# EAGLE board raceCapture (EAGLE 5.12)
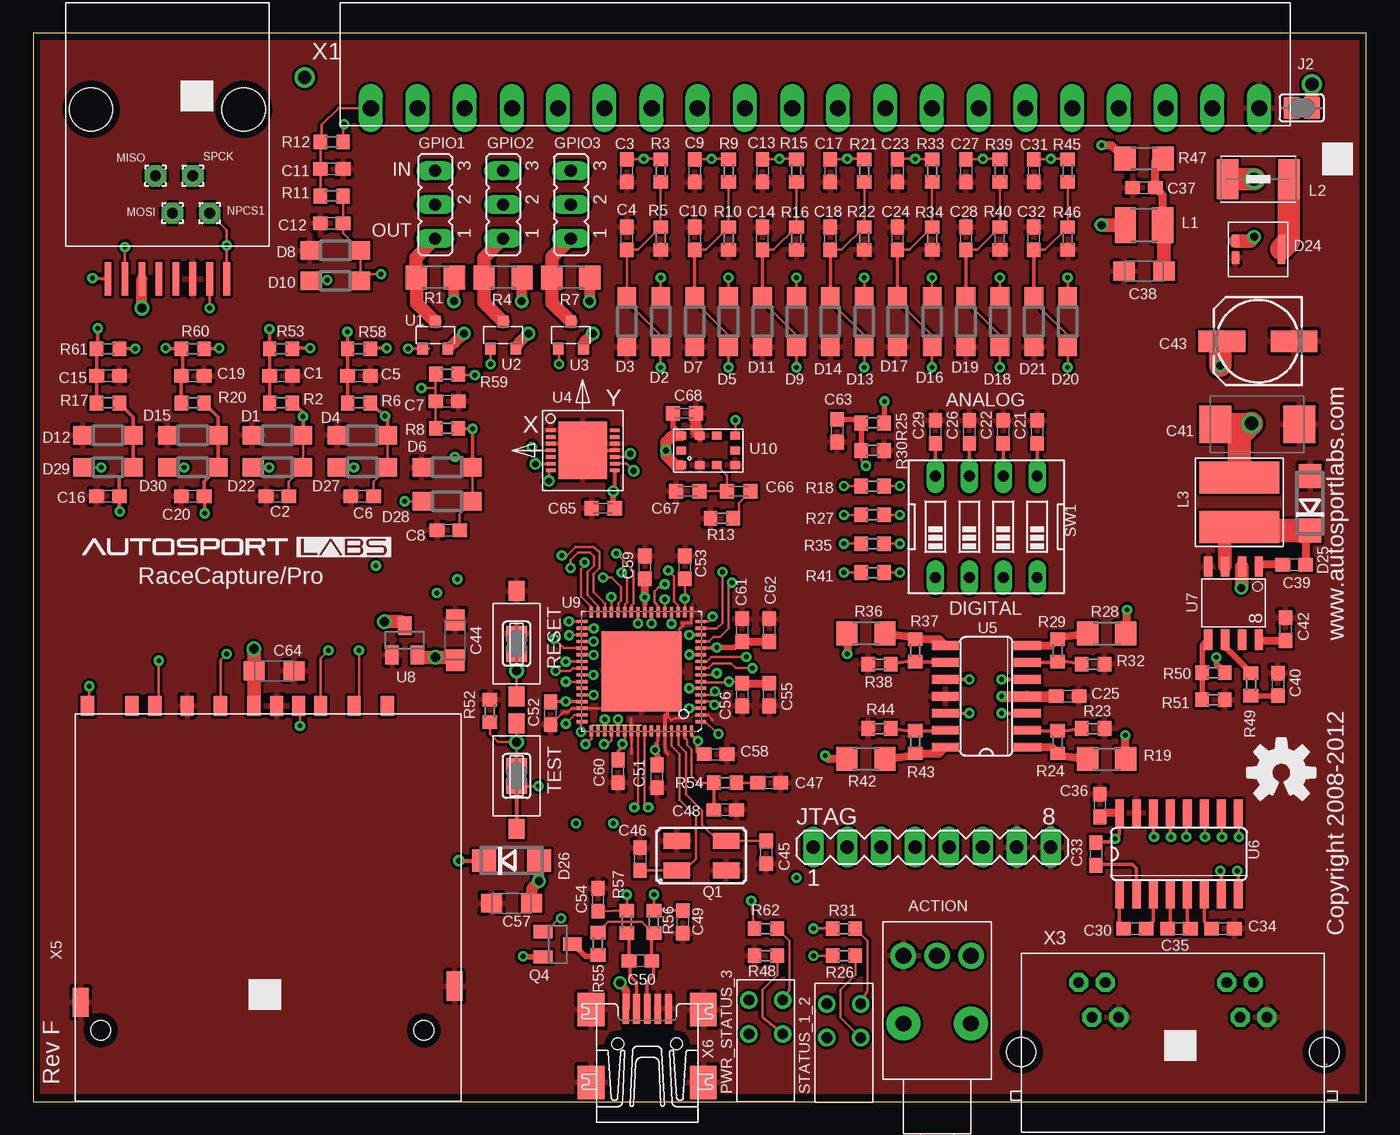
[diagram p8: board, top side]
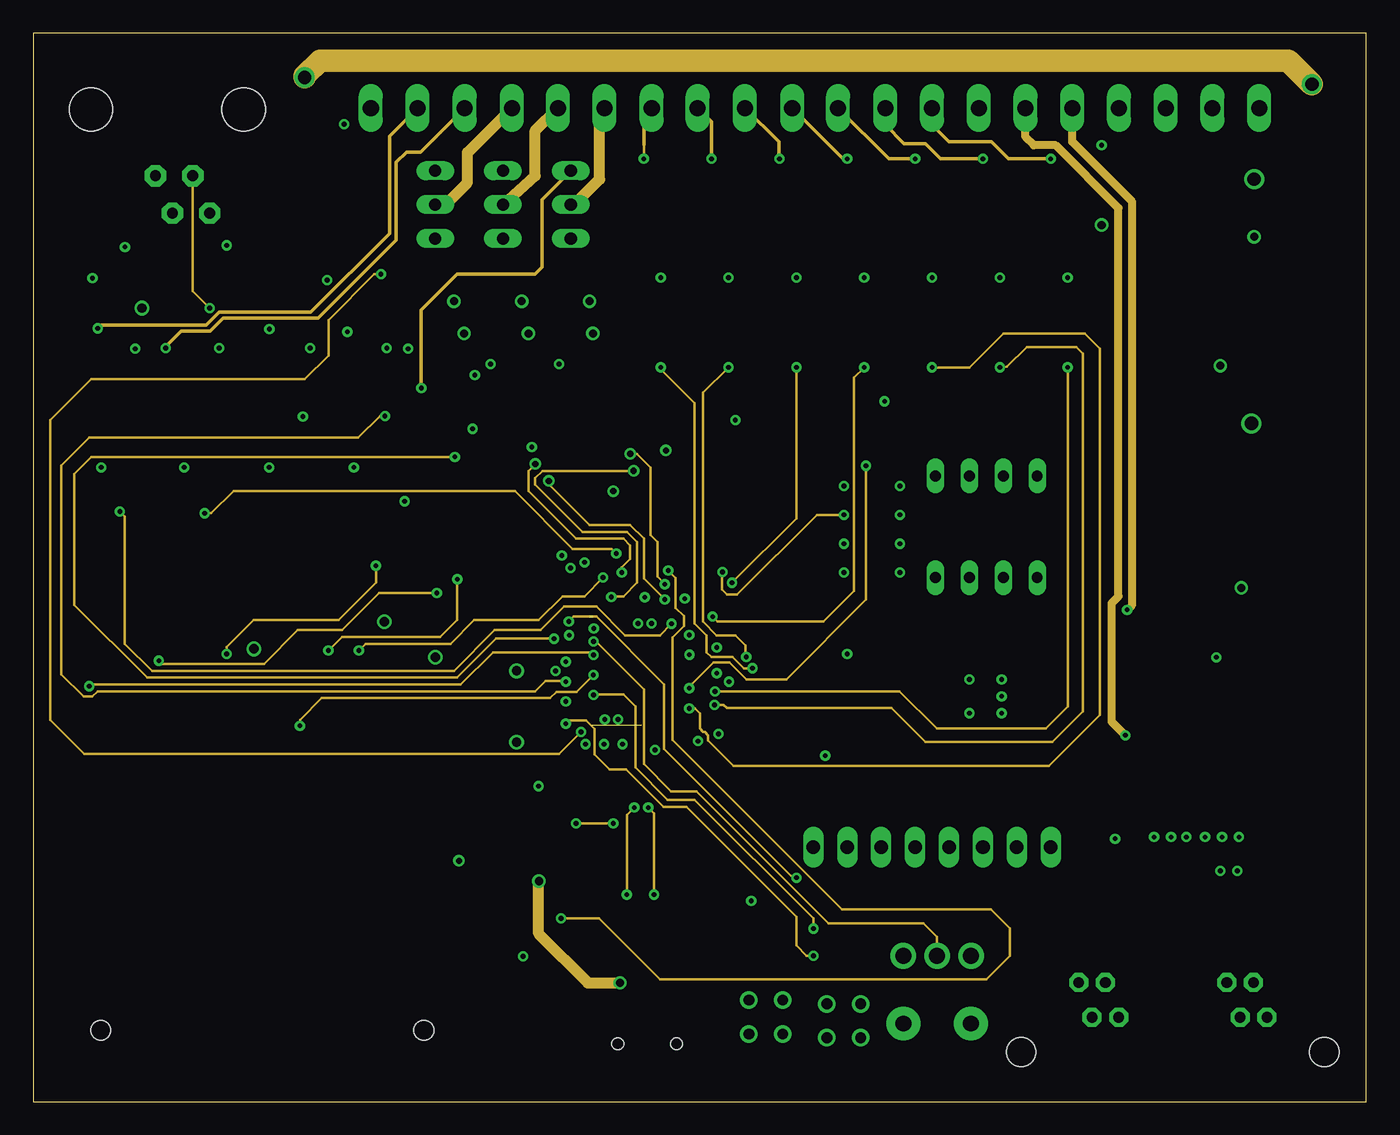
[diagram p9: board, inner layer Route2]
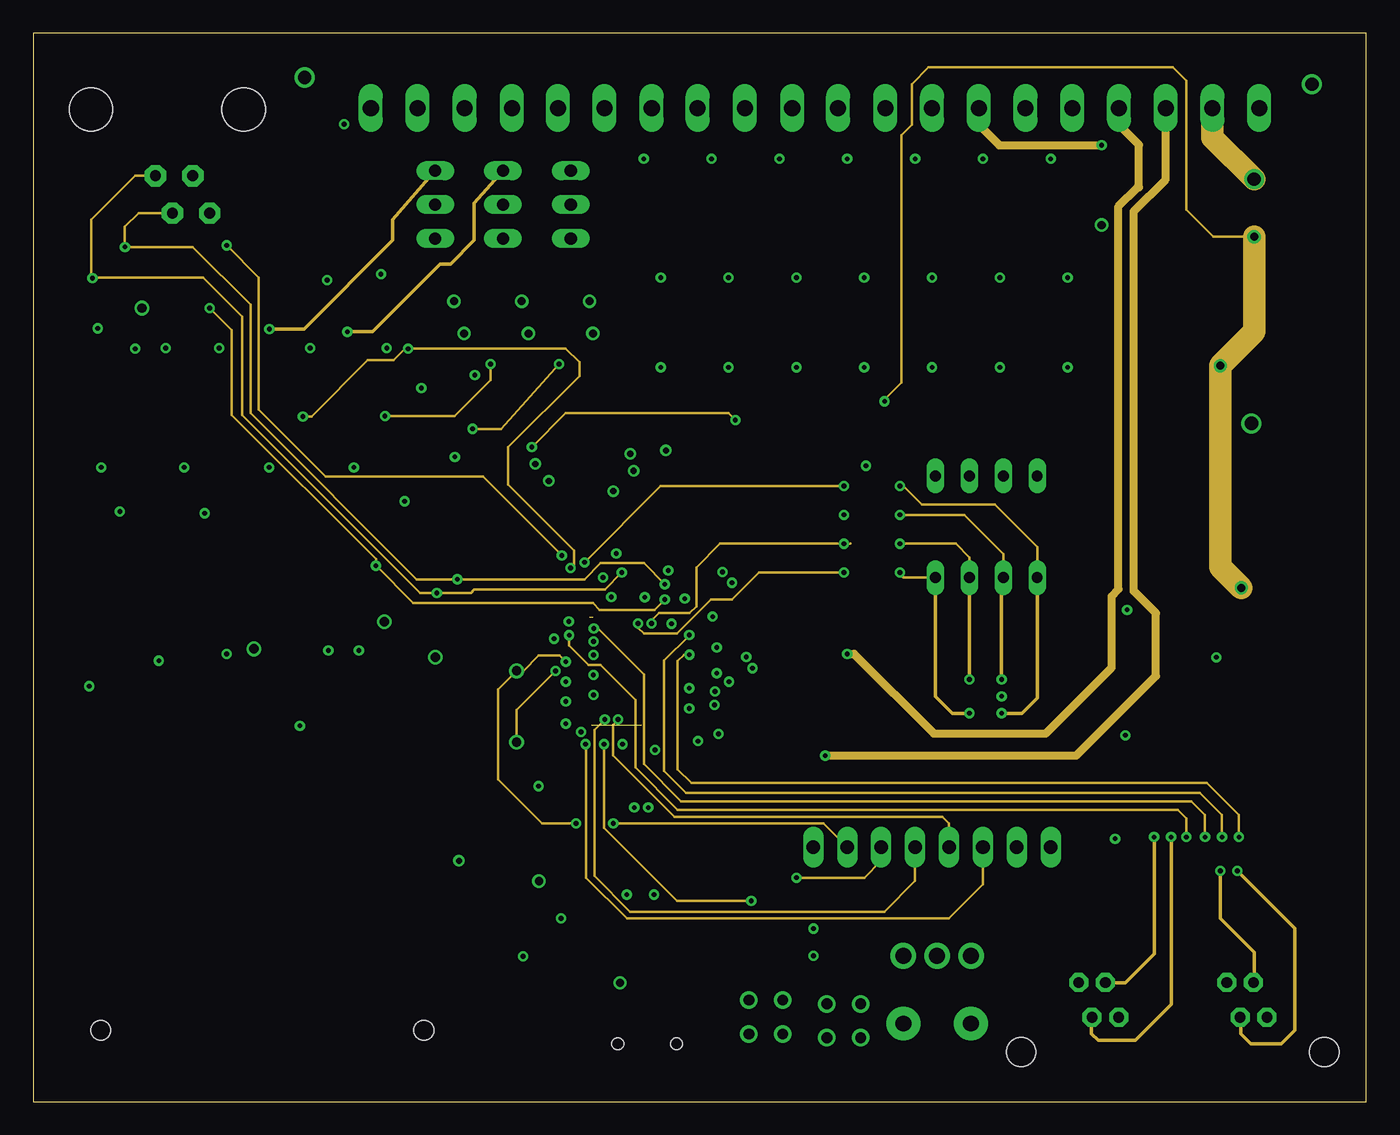
[diagram p10: board, inner layer Route15]
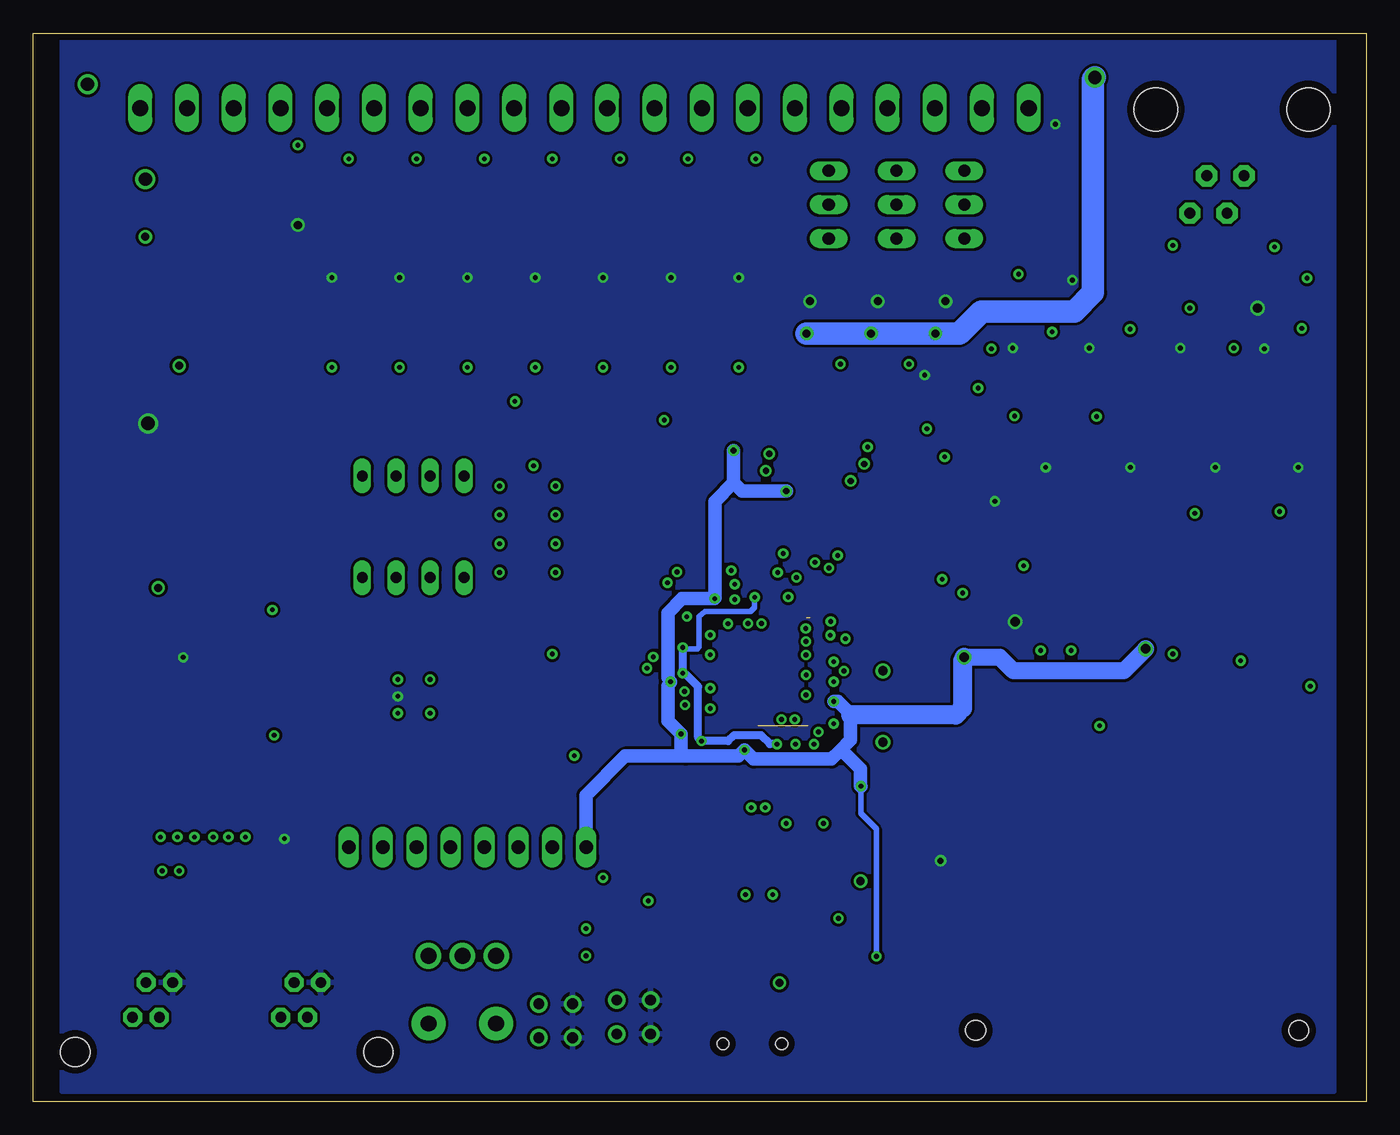
[diagram p11: board, bottom side, seen from below]

Size 99.82 x 80.01 mm. Coordinates in mm from the lower left corner, seen from the top.
Outline: 0,0 99.82,0 99.82,80.01 0,80.01 0,0
Copper layers (1+2*15+16): Top 0.035mm / dielectric 1.5mm / Route2 0.035mm / dielectric 0.15mm / Route15 0.035mm / dielectric 0.2mm / Bottom 0.035mm
Design rules "default *": minimum track width 8mil, minimum drill 14mil, track to track 8mil, track to pad 8mil, pad to pad 8mil, via to via 8mil, smd to smd 6mil, copper to edge 20mil, drill to drill 8mil, minimum pad ring 10mil, minimum via ring 8mil, stop-mask expansion 4mil, vias tented up to drill 24mil, thermal gap 10mil

## Footprints (pad centres in the part's own frame; a part is rotated, then mirrored left to right if it is on the bottom)
C0603 = smd 1.1 x 1: 1 -0.85,0; 2 0.85,0
SMC_A = smd 1.6 x 1.4: + -1.5,0; - 1.5,0
SMC_D = smd 2.4 x 2.8: + -3.15,0; - 3.15,0
153CLV-0605 = smd 3.5 x 1.6: + 2.7,0; - -2.7,0
C0603K = smd 1.05 x 1.08: 1 -0.875,0; 2 0.875,0
SOD123 = smd 1.4 x 1.4: A 1.9,0; C -1.9,0
POLYZEN = smd 0.559 x 2.21: P$1 0.356,0 | smd 0.559 x 0.94: P$2 3.797,0.635; P$3 3.797,-0.635
SMA = smd 1.8 x 1.7: A 2.05,0; C -2.05,0
JP2 = drill 0.914 long: 1 -2.54,0; 2 0,0; 3 2.54,0
JUMPER_CLOSED_THICK = smd 1.168 x 1.6: 1 -0.762,0; 2 0.762,0
MA08-1 = drill 1.016 long: 1 -8.89,0; 2 -6.35,0; 3 -3.81,0; 4 -1.27,0; 5 1.27,0; 6 3.81,0; 7 6.35,0; 8 8.89,0
1210 = smd 1.6 x 2.7: 1 -1.4,0; 2 1.4,0
1812 = smd 1.6 x 3: 1 -2.3,0; 2 2.3,0
CD54 = smd 6 x 2.4: P$1 0,1.85; P$2 0,-1.85
1,6/0,8 = drill 0.813 pad 1.6 octagon: 1 0,0
DUAL_PANEL_LED = drill 0.8 round: 1 -1.27,5.08; 2 1.27,5.08; 3 -1.27,7.62; 4 1.27,7.62
5X3.2 = smd 2 x 1.2: 1 -1.85,-1.1; 2 1.85,-1.1; 3 1.85,1.1; 4 -1.85,1.1
SOT23 = smd 1 x 1.4: 1 -0.95,-1.1; 2 0.95,-1.1; 3 0,1.1
R1206 = smd 1.6 x 1.803: 1 -1.422,0; 2 1.422,0
R0603 = smd 1 x 1.1: 1 -0.85,0; 2 0.85,0
SJ = smd 1.168 x 1.6: 1 -0.762,0; 2 0.762,0
DUAL_PANEL_LED_KINGBRIGHT = drill 0.8 round: 1 -1.27,4.826; 2 1.27,4.826; 3 -1.27,7.366; 4 1.27,7.366
EDG-04 = drill 0.813 long: 1 -3.81,-3.81; 2 -1.27,-3.81; 3 1.27,-3.81; 4 3.81,-3.81; 5 3.81,3.81; 6 1.27,3.81; 7 -1.27,3.81; 8 -3.81,3.81
EP12SD1ABE = drill 1.194 pad 2.54 round: BRACKET1 -2.54,-5.08; BRACKET2 2.54,-5.08 | drill 1.194 pad 1.93 round: P1 2.54,0; P2 0,0; P3 -2.54,0
TACT_6X3.5 = smd 1.5 x 1.2: P$1 -3.95,0; P$2 3.95,0
SOT-23 = smd 0.8 x 0.9: 1 -0.95,-1; 2 0.95,-1; 3 0,1
5X5_DFN = smd 0.7 x 0.28: 1 -2.4,1.51; 2 -2.4,1.01; 3 -2.4,0.51; 4 -2.4,0.01; 5 -2.4,-0.49; 6 -2.4,-0.99; 7 -2.4,-1.49; 8 2.4,-1.49; 9 2.4,-0.99; 10 2.4,-0.49; 11 2.4,0.01; 12 2.4,0.51; 13 2.4,1.01; 14 2.4,1.51 | smd 3.6 x 4.3: 15 0,0
SO14 = smd 0.66 x 2.032: 1 -3.81,-3.073; 2 -2.54,-3.073; 3 -1.27,-3.073; 4 0,-3.073; 5 1.27,-3.073; 6 2.54,-3.073; 7 3.81,-3.073; 8 3.81,3.073; 9 2.54,3.073; 10 1.27,3.073; 11 0,3.073; 12 -1.27,3.073; 13 -2.54,3.073; 14 -3.81,3.073
SOIC-16 = smd 0.66 x 2.032: 1 -4.445,-3.073; 2 -3.175,-3.073; 3 -1.905,-3.073; 4 -0.635,-3.073; 5 0.635,-3.073; 6 1.905,-3.073; 7 3.175,-3.073; 8 4.445,-3.073; 9 4.445,3.073; 10 3.175,3.073; 11 1.905,3.073; 12 0.635,3.073; 13 -0.635,3.073; 14 -1.905,3.073; 15 -3.175,3.073; 16 -4.445,3.073
SO-8 = smd 1.524 x 0.61: 1 -2.743,1.905; 2 -2.743,0.635; 3 -2.743,-0.635; 4 -2.743,-1.905; 5 2.743,-1.905; 6 2.743,-0.635; 7 2.743,0.635; 8 2.743,1.905
SOT-23' = smd 1 x 1.4: 1 -0.95,-1.1; 2 0.95,-1.1; 3 0,1.1
QFN64 = smd 0.8 x 0.25: 1 -4.45,3.75; 2 -4.45,3.25; 3 -4.45,2.75; 4 -4.45,2.25; 5 -4.45,1.75; 6 -4.45,1.25; 7 -4.45,0.75; 8 -4.45,0.25; 9 -4.45,-0.25; 10 -4.45,-0.75; 11 -4.45,-1.25; 12 -4.45,-1.75; 13 -4.45,-2.25; 14 -4.45,-2.75; 15 -4.45,-3.25; 16 -4.45,-3.75; 33 4.45,-3.75; 34 4.45,-3.25; 35 4.45,-2.75; 36 4.45,-2.25; 37 4.45,-1.75; 38 4.45,-1.25; 39 4.45,-0.75; 40 4.45,-0.25; 41 4.45,0.25; 42 4.45,0.75; 43 4.45,1.25; 44 4.45,1.75; 45 4.45,2.25; 46 4.45,2.75; 47 4.45,3.25; 48 4.45,3.75 | smd 0.25 x 0.8: 17 -3.75,-4.45; 18 -3.25,-4.45; 19 -2.75,-4.45; 20 -2.25,-4.45; 21 -1.75,-4.45; 22 -1.25,-4.45; 23 -0.75,-4.45; 24 -0.25,-4.45; 25 0.25,-4.45; 26 0.75,-4.45; 27 1.25,-4.45; 28 1.75,-4.45; 29 2.25,-4.45; 30 2.75,-4.45; 31 3.25,-4.45; 32 3.75,-4.45; 49 3.75,4.45; 50 3.25,4.45; 51 2.75,4.45; 52 2.25,4.45; 53 1.75,4.45; 54 1.25,4.45; 55 0.75,4.45; 56 0.25,4.45; 57 -0.25,4.45; 58 -0.75,4.45; 59 -1.25,4.45; 60 -1.75,4.45; 61 -2.25,4.45; 62 -2.75,4.45; 63 -3.25,4.45; 64 -3.75,4.45 | smd 6 x 6: PAD_GND 0,0
LGA-10 = smd 0.7 x 0.6: 1 -2.017,-1.1; 2 -0.635,-1.1; 3 0.635,-1.1; 4 2.017,-1.1; 5 2.017,0; 6 2.017,1.1; 7 0.635,1.1; 8 -0.635,1.1; 9 -2.017,1.1; 10 -2.017,0
20POL35 = drill 1.2 long: 1 -33.27,0; 2 -29.78,0; 3 -26.24,0; 4 -22.7,0; 5 -19.26,0; 6 -15.77,0; 7 -12.23,0; 8 -8.79,0; 9 -5.25,0; 10 -1.71,0; 11 1.73,0; 12 5.27,0; 13 8.77,0; 14 12.27,0; 15 15.77,0; 16 19.27,0; 17 22.77,0; 18 26.27,0; 19 29.77,0; 20 33.27,0
DUAL_RJ11_RIGHT_ANGLE_PCB = drill 0.8 pad 1.422 octagon: P1-1 7.3,8.6; P1-2 6.3,11.2; P1-3 5.3,8.6; P1-4 4.3,11.2; P2-1 18.4,8.6; P2-2 17.4,11.2; P2-3 16.4,8.6; P2-4 15.4,11.2 | hole 2.2: 22.7,6; 0,6
CNKLS_SMT_RJ45_JACK = smd 0.508 x 2.54: P1 -4.445,0; P2 -3.175,0; P3 -1.905,0; P4 -0.635,0; P5 0.635,0; P6 1.905,0; P7 3.175,0; P8 4.445,0 | hole 3.25: -5.715,-12.7; 5.715,-12.7
FCI_SD_CARD = smd 1 x 1.5: 1 6.875,29; 2 4.375,29; 3 1.075,29; 4 -0.625,29; 5 -3.125,29; 6 -5.625,29; 7 -8.05,29; 8 -9.75,29; 9 9.375,29; CD 2.725,29; WP -13.1,29 | smd 1.2 x 2.2: GND1 -13.6,6.8; GND2 14.4,8 | hole 1.5: 12.1,4.7; -12.1,4.7
MINI-USB_JACK = smd 2.25 x 0.5: 1 3.52,1.6; 2 3.52,0.8; 3 3.52,0; 4 3.52,-0.8; 5 3.52,-1.6 | smd 2.5 x 2: M1 -2,-4.2; M2 -2,4.2; M3 3.45,4.2; M4 3.45,-4.2 | hole 0.9: 0.9,-2.2; 0.9,2.2

## Placement (x,y rotation side)
C1  1nF  [C0603]  18.54,54.36 0 top
C2  0.1uF  [C0603]  18.29,45.34 180 top
C3  1nF  [C0603]  44.45,69.72 270 top
C4  0.1uF  [C0603]  44.45,64.64 90 top
C5  1nF  [C0603]  24.38,54.36 0 top
C6  0.1uF  [C0603]  24.64,45.34 180 top
C7  1nF  [C0603]  30.99,52.45 0 top
C8  0.1uF  [C0603]  31.09,42.8 180 top
C9  1nF  [C0603]  49.53,69.72 270 top
C10  0.1uF  [C0603]  49.53,64.64 90 top
C11  1nF  [C0603]  22.35,69.85 0 top
C12  10pf  [C0603]  22.35,65.79 180 top
C13  1nF  [C0603]  54.61,69.72 270 top
C14  0.1uF  [C0603]  54.61,64.64 90 top
C15  1nF  [C0603]  5.59,54.36 0 top
C16  10pf  [C0603]  5.59,45.34 180 top
C17  1nF  [C0603]  59.69,69.72 270 top
C18  0.1uF  [C0603]  59.69,64.64 90 top
C19  1nF  [C0603]  11.94,54.36 0 top
C20  10pf  [C0603]  11.94,45.34 180 top
C21  0.1uF  [C0603]  75.18,50.16 90 top
C22  0.1uF  [C0603]  72.64,50.16 90 top
C23  1nF  [C0603]  64.72,69.72 270 top
C24  0.1uF  [C0603]  64.72,64.64 90 top
C25  0.1uF  [C0603]  77.47,30.35 0 top
C26  0.1uF  [C0603]  70.1,50.16 90 top
C27  1nF  [C0603]  69.85,69.72 270 top
C28  0.1uF  [C0603]  69.85,64.64 90 top
C29  0.1uF  [C0603]  67.56,50.16 90 top
C30  0.1uF  [C0603]  82.5,12.95 0 top
C31  1nF  [C0603]  74.93,69.72 270 top
C32  0.1uF  [C0603]  74.93,64.64 90 top
C33  0.1uF  [C0603]  79.58,18.54 270 top
C34  0.1uF  [C0603]  89.1,12.95 0 top
C35  0.1uF  [C0603]  85.8,12.95 0 top
C36  0.1uF  [C0603]  79.88,22.17 90 top
C37  0.1uF  [C0603]  83.19,68.45 180 top
C38  10uF  [SMC_A]  83.19,62.2 180 top
C39  0.01uF  [C0603]  94.44,40.21 180 top
C40  560pF  [C0603]  93.22,31.24 270 top
C41  33uF  [SMC_D]  91.67,50.72 0 top
C42  0.01uF  [C0603]  93.78,35.38 270 top
C43  22uF  [153CLV-0605]  91.72,56.95 180 top
C44  10uF  [SMC_A]  31.6,34.57 90 top
C45  10pF  [C0603]  54.89,18.67 90 top
C46  10pF  [C0603]  45.44,18.16 270 top
C47  0.01uF  [C0603]  55.12,23.88 0 top
C48  1nF  [C0603]  51.82,21.84 0 top
C49  15pF  [C0603]  48.64,13.46 90 top
C50  33pF  [C0603]  45.47,10.54 0 top
C51  0.1uF  [C0603]  46.71,24.36 90 top
C52  0.1uF  [C0603]  38.73,29.08 90 top
C53  0.1uF  [C0603]  48.79,40.01 270 top
C54  15pF  [C0603]  42.29,15.11 270 top
C55  0.1uF  [C0603]  55.12,30.48 270 top
C56  2.2uF  [C0603]  53.09,30.48 270 top
C57  10uF  [SMC_A]  35.81,14.86 180 top
C58  0.1uF  [C0603]  51.1,26.01 180 top
C59  0.1uF  [C0603]  45.8,40.01 270 top
C60  0.1uF  [C0603]  43.79,24.74 90 top
C61  2.2uF  [C0603]  53.09,35.31 270 top
C62  1nF  [C0603]  55.12,35.31 270 top
C63  0.1uF  [C0603]  60.2,50.24 270 top
C64  10uF  [SMC_A]  18.03,32.26 0 top
C65  0.1uf  [C0603K]  42.67,44.45 180 top
C66  470nF  [C0603K]  52.83,45.72 180 top
C67  10nf  [C0603K]  49.02,45.72 180 top
C68  0.1uf  [C0603K]  48.77,51.56 0 top
D1  schottky  [SOD123]  18.29,49.91 180 top
D2  schottky  [SOD123]  46.99,58.42 270 top
D3  schottky  [SOD123]  44.45,58.42 270 top
D4  schottky  [SOD123]  24.64,49.91 180 top
D5  schottky  [SOD123]  52.07,58.42 270 top
D6  schottky  [SOD123]  30.99,47.5 180 top
D7  schottky  [SOD123]  49.53,58.42 270 top
D8  schottky  [SOD123]  22.61,63.75 180 top
D9  schottky  [SOD123]  57.15,58.42 270 top
D10  schottky  [SOD123]  22.61,61.47 0 top
D11  schottky  [SOD123]  54.61,58.42 270 top
D12  schottky  [SOD123]  5.59,49.91 180 top
D13  schottky  [SOD123]  62.23,58.42 270 top
D14  schottky  [SOD123]  59.69,58.42 270 top
D15  schottky  [SOD123]  11.94,49.91 180 top
D16  schottky  [SOD123]  67.31,58.42 270 top
D17  schottky  [SOD123]  64.72,58.42 270 top
D18  schottky  [SOD123]  72.39,58.42 270 top
D19  schottky  [SOD123]  69.85,58.42 270 top
D20  schottky  [SOD123]  77.47,58.42 270 top
D21  schottky  [SOD123]  74.93,58.42 270 top
D22  schottky  [SOD123]  18.29,47.5 0 top
D24  POLYZEN  [POLYZEN]  93.83,63.83 180 top
D25  SCHOTTKY  [SMA]  95.63,44.81 90 top
D26  SCHOTTKY  [SMA]  35.81,18.03 0 top
D27  schottky  [SOD123]  24.64,47.5 0 top
D28  schottky  [SOD123]  30.99,44.96 0 top
D29  schottky  [SOD123]  5.59,47.5 0 top
D30  schottky  [SOD123]  11.94,47.5 0 top
GPIO1  [JP2]  30.1,67.18 90 top
GPIO2  [JP2]  35.18,67.18 90 top
GPIO3  [JP2]  40.26,67.18 90 top
J2  JUMPER_CLOSEDTHICK  [JUMPER_CLOSED_THICK]  95,74.42 180 top
JTAG  [MA08-1]  67.31,19.05 0 top
L1  1uH  [1210]  83.19,65.66 0 top
L2  [1812]  91.74,69.09 180 top
L3  CD54  [CD54]  90.32,44.88 0 top
MISO  WIREPAD1,6/0,8  [1,6/0,8]  9.14,69.34 0 top
MOSI  WIREPAD1,6/0,8  [1,6/0,8]  10.41,66.55 0 top
NPCS1  WIREPAD1,6/0,8  [1,6/0,8]  13.21,66.55 0 top
PWR_STATUS_3  DUAL_PANEL_LED  [DUAL_PANEL_LED]  54.86,-0.03 0 top
Q1  18.432MHz  [5X3.2]  50.04,18.41 0 top
Q4  BSS84  [SOT23]  39.27,11.79 270 top
R1  1K  [R1206]  30.1,61.72 0 top
R2  5.1K  [R0603]  18.54,52.32 0 top
R3  5.1K 1%  [R0603]  46.99,69.72 270 top
R4  1K  [R1206]  35.18,61.72 0 top
R5  10K 1%  [R0603]  46.99,64.64 90 top
R6  5.1K  [R0603]  24.38,52.32 0 top
R7  1K  [R1206]  40.26,61.72 0 top
R8  5.1K  [R0603]  30.99,50.42 0 top
R9  5.1K 1%  [R0603]  52.07,69.72 270 top
R10  10K 1%  [R0603]  52.07,64.64 90 top
R11  5.1K  [R0603]  22.35,67.82 0 top
R12  10K  [R0603]  22.35,71.88 0 top
R13  10K  [R0603]  51.56,43.69 180 top
R15  5.1K 1%  [R0603]  57.15,69.72 270 top
R16  10K 1%  [R0603]  57.15,64.64 90 top
R17  5.1K  [R0603]  5.59,52.32 0 top
R18  5.1K  [R0603]  62.87,46.1 180 top
R19  PTC 50mA  [R1206]  80.39,25.65 180 top
R20  5.1K  [R0603]  11.94,52.32 0 top
R21  5.1K 1%  [R0603]  62.23,69.72 270 top
R22  10K 1%  [R0603]  62.23,64.64 270 top
R23  10K 1%  [R0603]  79.38,27.94 180 top
R24  5.1K 1%  [R0603]  76.71,26.92 90 top
R25  43K 1%  [R0603]  62.87,50.83 180 top
R26  270  [R0603]  60.71,10.92 180 top
R27  5.1K  [R0603]  62.87,43.94 180 top
R28  PTC 50mA  [R1206]  80.39,35.05 180 top
R29  5.1K 1%  [R0603]  76.71,33.78 270 top
R30  10K 1%  [R0603]  62.87,48.77 0 top
R31  270  [R0603]  60.71,12.95 180 top
R32  10K 1%  [R0603]  79.38,32.77 180 top
R33  5.1K 1%  [R0603]  67.31,69.72 270 top
R34  10K 1%  [R0603]  67.31,64.64 90 top
R35  5.1K  [R0603]  62.87,41.78 180 top
R36  PTC 50mA  [R1206]  62.36,35.05 0 top
R37  5.1K 1%  [R0603]  66.04,33.78 270 top
R38  10K 1%  [R0603]  63.37,32.77 0 top
R39  5.1K 1%  [R0603]  72.39,69.72 270 top
R40  10K 1%  [R0603]  72.39,64.64 90 top
R41  5.1K  [R0603]  62.87,39.62 180 top
R42  PTC 50mA  [R1206]  62.36,25.65 0 top
R43  5.1K 1%  [R0603]  66.04,26.92 90 top
R44  10K 1%  [R0603]  63.37,27.94 0 top
R45  5.1K 1%  [R0603]  77.47,69.72 270 top
R46  10K 1%  [R0603]  77.47,64.64 90 top
R47  PTC 50mA  [R1206]  83.19,70.61 0 top
R48  270  [R0603]  54.86,10.92 180 top
R49  43K  [R0603]  91.19,31.24 270 top
R50  18K 1%  [R0603]  88.39,32.13 180 top
R51  2.43K 1%  [R0603]  88.39,30.1 0 top
R52  1.5K  [R0603]  34.19,29.26 90 top
R53  10K  [R0603]  18.54,56.39 0 top
R54  1.5K  [R0603]  51.82,23.88 180 top
R55  1.5K  [R0603]  42.29,11.81 270 top
R56  27  [R0603]  46.48,13.46 90 top
R57  27  [R0603]  44.45,13.46 90 top
R58  10K  [R0603]  24.38,56.39 0 top
R59  10K  [R0603]  30.99,54.48 0 top
R60  10K  [R0603]  11.94,56.39 0 top
R61  10K  [R0603]  5.59,56.39 0 top
R62  270  [R0603]  54.86,12.95 0 top
RESET  [SJ]  36.2,34.29 90 top
SPCK  WIREPAD1,6/0,8  [1,6/0,8]  11.94,69.34 0 top
STATUS_1_2  DUAL_PANEL_LEDKINGBRIGHT  [DUAL_PANEL_LED_KINGBRIGHT]  60.71,-0.05 0 top
SW1  [EDG-04]  71.37,43.05 0 top
SW2  EP12SD1ABE  [EP12SD1ABE]  67.69,10.92 0 top
SW3  6X3.5_TACT  [TACT_6X3.5]  36.2,34.29 90 top
SW4  6X3.5_TACT  [TACT_6X3.5]  36.2,24.38 90 top
TEST  [SJ]  36.2,24.38 90 top
U1  ZXMS6004FF  [SOT-23]  30.1,57.4 0 top
U2  ZXMS6004FF  [SOT-23]  35.18,57.4 0 top
U3  ZXMS6004FF  [SOT-23]  40.26,57.4 0 top
U4  KXR94-2353  [5X5_DFN]  41.15,48.77 0 top
U5  TLV274  [SO14]  71.37,30.35 90 top
U6  HIN232A  [SOIC-16]  85.8,18.54 0 top
U7  FAN8303  [SO-8]  89.89,37.34 270 top
U8  MCP1700  [SOT-23']  27.81,34.54 0 top
U9  AT91SAM7S512/256/128/64/321-MU  [QFN64]  45.54,32.21 180 top
U10  LY330ALH  [LGA-10]  50.55,48.77 0 top
X1  MPT20  [20POL35]  58.55,74.42 0 top
X3  GENERIC_DUAL_RJ11  [DUAL_RJ11_RIGHT_ANGLE_PCB]  73.99,-2.29 0 top
X4  CNKLS_RJ45_SMT  [CNKLS_SMT_RJ45_JACK]  10.04,61.62 180 top
X5  CARD_CONNECTOR_SDFCI  [FCI_SD_CARD]  17.14,0.64 0 top
X6  MINI_USB_SHIELD  [MINI-USB_JACK]  45.97,3.43 90 top

## Tracks (layer width: path | path; a pad name or v marks a point on that pad's centre or on a via)
+5V  (via drill 0.36, 0.46, 0.6, 0.7, 1)
  Top 0.203: D2.C v46.99,61.72 | D5.C v52.07,61.72 | D9.C v57.15,61.72 | D13.C v62.23,61.72 | D16.C v67.31,61.72 | D18.C v72.39,61.72 | D20.C v77.47,61.72 | R59.2 31.86,54.41 v33.07,54.41 | D29.C v5.08,47.5 | D30.C v11.3,47.5 | D22.C v17.65,47.5 | D27.C v24,47.5 | v27.81,44.96 D28.C | R12.2 23.2,73.14 v23.27,73.2
  Top 0.254: C33.1 79.62,19.43 80.77,19.43 v81.03,19.68 81.36,20.02 U6.16 81.52,21.78 | R61.2 v7.62,56.39 | R60.2 13.87,56.39 v13.92,56.44 | R53.2 19.44,56.44 v20.73,56.44 | R58.2 25.29,56.44 v26.47,56.44 | D10.C 21.95,61.47 v22,61.52
  Top 0.305: v31.88,18.03 D26.C
  Top 0.406: R50.1 88.59,32.78 v88.59,33.27
  Top 0.61: v80.01,65.66 79.75,65.66 79.75,65.65 | C36.1 80.17,21.61 U6.16
  Top 0.813: R1.2 31.52,59.97 v31.5,59.94 | R4.2 36.6,59.97 v36.58,59.94 | R7.2 41.68,59.97 v41.66,59.94 | v72.52,30.35 U5.4 C25.1 | X4.P6 v8.13,59.44
  Top 1.016: v80.01,65.66 L1.1 | v26.29,35.94 27.52,35.94 U8.3
  Top 1.778: C41.+ 91.16,50.72 v91.24,50.8 90.32,49.89 L3.P$1
  pour Bottom: 2.41,79.5 2.41,0.76 97.66,0.76 97.66,79.5
+12V  (via drill 1)
  Top 1.676: L2.2 v91.44,69.09
  Route15 1.676: X1.19 88.32,72.21 v91.44,69.09
ACTION_SW  (via drill 0.36)
  Top 0.203: v41.95,34.46 U9.36 | U9.36
  Route2 0.203: SW2.P2 67.69,12.32 66.67,13.34 59.56,13.34 49.66,23.24 47.75,23.24 45.72,25.27 45.72,30.86 42.16,34.42 41.96,34.42 v41.95,34.46
ANALOG-FREQ_1_OPAMP_OUT
  Top 0.254: R24.1 76.87,25.91
  Top 0.61: 76.87,25.91 R19.2 | R24.1 76.24,26.54 U5.1
ANALOG-FREQ_1_OUT  (via drill 0.36)
  Top 0.61: R19.1 81.79,25.68 v81.79,27.43
  Route2 0.61: v81.79,27.43 80.77,28.45 80.77,37.34 81.28,37.85 81.28,66.93 76.58,71.63 74.93,71.63 74.32,72.24 X1.15
ANALOG-FREQ_2_OPAMP_OUT
  Top 0.254: R29.1 76.87,34.8
  Top 0.61: U5.7 76.24,34.16 R29.1 | 76.87,34.8 R28.2
ANALOG-FREQ_2_OUT  (via drill 0.36)
  Top 0.61: R28.1 81.92,35.15 v81.92,36.83
  Route2 0.61: v81.92,36.83 82.3,37.21 82.3,67.4 77.82,71.88 X1.16
ANALOG-FREQ_3_OPAMP_OUT
  Top 0.254: 65.87,34.8 R37.1
  Top 0.61: U5.8 67.83,34.63 R37.1 | R36.2 65.87,34.8
ANALOG-FREQ_3_OUT  (via drill 0.36)
  Top 0.61: R36.1 60.96,35.03 v60.96,33.53
  Route15 0.61: v60.96,33.53 61.47,33.53 67.44,27.56 75.82,27.56 80.77,32.51 80.77,37.85 81.28,38.35 81.28,67.06 82.68,68.45 82.8,68.45 82.8,71.67 81.32,73.15 X1.17
ANALOG-FREQ_4_OPAMP_OUT
  Top 0.254: 65.87,25.91 R43.1
  Top 0.61: U5.14 67.83,26.07 R43.1 | R42.2 65.87,25.91
ANALOG-FREQ_4_OUT  (via drill 0.36)
  Top 0.61: v59.31,25.91 59.56,25.65 R42.1
  Route15 0.61: v59.31,25.91 78.11,25.91 84.07,31.88 84.07,36.58 82.42,38.23 82.42,66.67 84.82,69.07 X1.18 84.71,73.26
ANALOG_1_ADC  (via drill 0.36)
  Top 0.203: R3.2 R5.2 45.29,63.79 C4.1 D3.C 44.45,60.2 44.96,59.69 44.96,59.44 46.99,57.4 D2.A v46.99,54.99 | U9.9 50.02,32.48 50.57,32.48 50.9,32.82 52.25,32.82 52.61,32.46 v53.84,32.46 v53.85,32.45
  Route2 0.203: v53.85,32.45 53.22,32.45 52.38,33.3 50.77,33.3 50.42,33.66 50.42,34.92 49.53,35.81 49.53,52.32 46.99,54.86 v46.99,54.99
ANALOG_1_ENABLE_CAP
  Top 0.254: SW1.5 C21.1
ANALOG_1_IN  (via drill 0.36)
  Top 0.203: C3.1 45.68,70.57 v45.72,70.61 46.95,70.61 R3.1
  Route2 0.203: v45.72,70.61 45.72,71.67
  Route2 0.254: 45.72,71.67 45.72,73.75 X1.7
ANALOG_1_OPAMP_IN  (via drill 0.36)
  Top 0.203: v64.9,46.1 R18.1
  Top 0.254: v72.52,29.08 U5.3
  Route15 0.203: v64.9,46.1 65.15,46.1 66.55,44.7 72.01,44.7 75.18,41.53 SW1.4
  Route15 0.254: SW1.4 75.18,30.23 74.04,29.08 v72.52,29.08
ANALOG_2_ADC  (via drill 0.36)
  Top 0.203: C10.1 50.37,63.79 R10.2 R9.2 | D7.C 49.66,60.32 50.04,59.94 50.04,59.44 52.07,57.4 D5.A v52.07,54.99 | U9.10 50.01,32.94 50.43,32.94 50.8,33.3 v53.39,33.3
  Top 0.254: D7.C C10.1
  Route2 0.203: v53.39,33.3 53.34,33.31 53.34,34.16 52.58,34.92 51.18,34.92 50.16,35.94 50.16,53.09 v52.07,54.99
ANALOG_2_ENABLE_CAP
  Top 0.254: SW1.6 C22.1
ANALOG_2_IN  (via drill 0.36)
  Top 0.203: C9.1 50.76,70.57 v50.8,70.61 52.03,70.61 R9.1
  Route2 0.254: v50.8,70.61 50.8,73.38 X1.8
ANALOG_2_OPAMP_IN  (via drill 0.36)
  Top 0.203: v64.9,43.94 R27.1
  Top 0.254: v72.52,31.62 U5.5
  Route15 0.203: v64.9,43.94 69.72,43.94 72.64,41.02 SW1.3
  Route15 0.254: SW1.3 72.52,39.12 v72.52,31.62
ANALOG_3_ADC  (via drill 0.36)
  Top 0.203: C14.1 55.45,63.79 R16.2 R15.2 | D11.C 54.61,60.2 55.12,59.69 55.12,59.44 57.15,57.4 D9.A v57.15,54.99 | U9.13 50.59,34.46 50.93,34.8 51.44,34.8 52.07,35.43 52.07,38.61 v52.32,38.86
  Top 0.254: D11.C C14.1
  Route2 0.203: v52.32,38.86 57.15,43.69 v57.15,54.99
ANALOG_3_ENABLE_CAP
  Top 0.254: SW1.7 C26.1
ANALOG_3_IN  (via drill 0.36)
  Top 0.203: C13.1 55.84,70.57 v55.88,70.61 57.11,70.61 R15.1
  Route2 0.254: v55.88,70.61 55.84,70.61 55.84,71.88 X1.9
ANALOG_3_OPAMP_IN  (via drill 0.36)
  Top 0.203: v64.9,41.78 R35.1
  Top 0.254: U5.10 v70.1,31.62
  Route15 0.203: v64.9,41.78 69.09,41.78 70.1,40.77 SW1.2
  Route15 0.254: v70.1,31.62 SW1.2
ANALOG_4_ADC  (via drill 0.36)
  Top 0.203: C18.1 60.53,63.79 R22.1 R21.2 | D14.C 59.82,60.32 60.2,59.94 60.2,59.44 62.23,57.4 D13.A v62.23,54.99 | v50.88,36.32 50.92,36.32 50.56,35.96 U9.16
  Top 0.254: D14.C C18.1
  Route2 0.203: v50.88,36.32 51.26,35.94 59.18,35.94 61.47,38.23 61.47,54.23 v62.23,54.99
ANALOG_4_ENABLE_CAP
  Top 0.254: SW1.8 C29.1
ANALOG_4_IN  (via drill 0.36)
  Top 0.203: C17.1 60.92,70.57 v60.96,70.61 62.19,70.61 R21.1
  Route2 0.254: X1.10 60.65,70.61 v60.96,70.61
ANALOG_4_OPAMP_IN  (via drill 0.36)
  Top 0.203: v64.9,39.62 R41.1
  Top 0.254: U5.12 v70.1,29.08
  Route15 0.203: v64.9,39.62 65.15,39.24 SW1.1
  Route15 0.254: SW1.1 67.56,30.35 68.83,29.08 v70.1,29.08
ANALOG_5_ADC  (via drill 0.36)
  Top 0.203: C24.1 65.61,63.79 R34.2 R33.2 | D17.C 64.72,60.25 65.28,59.69 65.28,59.44 67.31,57.4 D16.A v67.31,54.99 | v49.13,29.45 U9.3
  Top 0.254: D17.C C24.1
  Route2 0.203: v67.31,54.99 70.1,54.99 72.64,57.53 78.74,57.53 79.88,56.39 79.88,28.96 76.07,25.15 52.45,25.15 50.55,27.05 50.55,27.43 50.29,27.69 50.16,27.69 49.91,27.94 49.91,29.08 49.54,29.46 v49.13,29.45
ANALOG_5_IN  (via drill 0.36)
  Top 0.203: C23.1 64.76,70.61 v66.04,70.61 66.08,70.57 R33.1
  Route2 0.254: X1.11 64.09,70.61 v66.04,70.61
ANALOG_6_ADC  (via drill 0.36)
  Top 0.203: C28.1 70.69,63.79 R40.2 R39.2 | D19.C 69.98,60.32 70.36,59.94 70.36,59.44 72.39,57.4 D18.A 72.39,55.15 v72.4,54.99 | v51.01,29.7 50.94,29.83 50.81,29.96 U9.4
  Top 0.254: D19.C C28.1
  Route2 0.203: v72.4,54.99 72.91,55.04 74.42,56.52 78.11,56.52 78.61,56.01 78.61,29.21 76.33,26.92 66.8,26.92 64.26,29.46 51.94,29.46 51.7,29.7 v51.01,29.7
ANALOG_6_IN  (via drill 0.36)
  Top 0.203: C27.1 71.08,70.57 v71.12,70.61 72.35,70.61 R39.1
  Route2 0.254: v71.12,70.61 67.94,70.61 66.8,71.75 65.21,71.75 63.82,73.15 X1.12
ANALOG_7_ADC  (via drill 0.36)
  Top 0.203: C32.1 75.77,63.79 R46.2 R45.2 | D21.C 75.06,60.32 75.44,59.94 75.44,59.44 77.47,57.4 D20.A v77.47,54.99 | U9.5 50.78,30.46 v51.05,30.71
  Top 0.254: D21.C C32.1
  Route2 0.203: v77.47,54.99 77.47,29.59 75.82,27.94 67.67,27.94 64.87,30.73 51.08,30.73 v51.05,30.71
ANALOG_7_IN  (via drill 0.36)
  Top 0.203: C31.1 76.16,70.57 v76.2,70.61 77.43,70.61 R45.1
  Route2 0.254: v76.2,70.61 73.03,70.61 71.75,71.88 68.59,71.88 67.32,73.15 X1.13
ANALOG_OUT_1_PWM  (via drill 0.36)
  Top 0.203: v60.71,46.1 R18.2 | U9.32 41.78,37.08 41.02,37.85 41.02,39.88 41.27,40.13 v41.27,40.39
  Route15 0.203: v60.71,46.1 46.99,46.1 v41.27,40.39
ANALOG_OUT_2_PWM  (via drill 0.36)
  Top 0.203: U9.15 50.02,35.43 51.18,35.43 51.61,35.86 51.61,38.59 v51.61,39.67 | v60.71,43.94 R27.2
  Route2 0.203: v51.61,39.67 51.56,39.62 51.56,38.35 51.94,37.97 52.7,37.97 58.67,43.94 v60.71,43.94
ANALOG_OUT_3_PWM  (via drill 0.36)
  Top 0.203: v60.71,41.78 R35.2 | U9.23 v46.29,35.81 | U9.23
  Route15 0.203: 61.21,41.78 v60.71,41.78 51.44,41.78 49.66,40.01 49.66,37.08 49.15,36.58 46.86,36.58 46.31,36.02 46.31,35.82 v46.29,35.81
ANALOG_OUT_4_PWM  (via drill 0.36)
  Top 0.203: v60.71,39.62 R41.2 | v45.29,35.81 U9.25
  Route15 0.203: v60.71,39.62 54.36,39.62 52.32,37.59 50.75,37.59 48.21,35.05 45.72,35.05 45.29,35.48 45.29,35.86 v45.29,35.81
AUX  (via drill 0.36)
  Top 0.203: U10.6 52.58,49.88 v52.58,51.05 | v37.34,49.02 37.33,48.78 U4.4
  Route15 0.203: v52.58,51.05 52.07,51.56 39.88,51.56 v37.34,49.02
BATT_VOLTAGE_ADC  (via drill 0.36)
  Top 0.203: R30.1 62.02,47.97 v62.36,47.62 | U9.6 49.03,30.96 v49.13,30.95
  Top 0.406: C63.1 62.02,51.09 R25.2 R30.1
  Route2 0.203: v62.36,47.62 62.36,37.59 56.39,31.62 53.42,31.62 52.15,32.89 50.93,32.89 49.13,31.1 v49.13,30.95
DDM  (via drill 0.36)
  Top 0.203: v44.45,15.49 R57.2 C54.2 | v45.01,22.02 45.29,22.3 45.29,27.8
  Top 0.254: 45.29,27.8 U9.56
  Route2 0.203: v44.45,15.49 44.45,21.46 v45.01,22.02
DDP  (via drill 0.36)
  Top 0.203: v46.48,15.49 R56.2 C49.2 | v46.05,22.02 45.79,22.28 U9.57
  Route2 0.203: v46.48,15.49 46.48,21.59 v46.05,22.02
FREQ_1_IN
  Top 0.203: R11.1 C11.1 R12.1 21.59,71.97 21.59,73.15 22.86,74.42 X1.1
FREQ_1_IN_TIM  (via drill 0.36)
  Top 0.203: v41.02,27.69 41.02,28.39 U9.48 | v26.04,61.98 25.01,61.98 D10.A D8.C 23.2,65.06 C12.1 R11.2
  Route2 0.203: v41.02,27.69 39.37,26.04 3.81,26.04 1.27,28.57 1.27,51.05 4.32,54.1 20.32,54.1 22.1,55.88 22.1,58.55 25.53,61.98 v26.04,61.98
FREQ_2_IN  (via drill 0.36)
  Top 0.254: C15.1 4.83,54.57 | v4.83,57.91 4.83,56.48 R61.1 C15.1 | R17.1 C15.1
  Route2 0.254: v4.83,57.91 5.08,58.17 12.95,58.17 13.92,59.13 20.78,59.13 26.67,65.02 26.67,72.33 X1.2
FREQ_2_IN_TIM  (via drill 0.36)
  Top 0.203: U9.20 v47.8,35.79
  Top 0.254: R17.2 7.49,51.27 D12.C D29.A 6.44,46.7 C16.1 6.44,44.23 v6.48,44.2
  Route2 0.203: v6.48,44.2 6.86,43.81 6.86,34.29 8.89,32.26 31.5,32.26 34.54,35.31 37.97,35.31 39.75,37.08 42.16,37.08 44.32,34.92 46.93,34.92 v47.8,35.79
FREQ_3_IN  (via drill 0.36)
  Top 0.254: R20.1 C19.1 11.18,54.57 11.18,56.3 R60.1 9.96,56.39 v9.91,56.44
  Route2 0.254: v9.91,56.44 9.91,56.54 11.07,57.71 13.26,57.71 14.22,58.67 21.34,58.67 27.18,64.52 27.18,70.36 27.94,71.12 29,71.12 X1.3
FREQ_3_IN_TIM  (via drill 0.36)
  Top 0.203: U9.26 44.79,37.15 44.96,37.31 44.96,39.75 v43.66,41.05
  Top 0.254: R20.2 13.84,51.27 D15.C D30.A 12.79,46.45 C20.1 12.83,45.3 v12.83,44.07
  Route2 0.203: v12.83,44.07 13.34,44.07 14.99,45.72 36.07,45.72 40.39,41.4 43.31,41.4 v43.66,41.05
GND
  Top 0.203: U9.17 49.28,36.61 49.28,36.6 49.28,35.84 48.54,35.84 48.64,35.71 48.64,35.64 48.41,35.41 48.41,34.91 48.15,34.65 48.12,34.65 | U9.60 47.3,26.31 47.45,26.11 47.55,26.01 | U9.60 47.3,27.84 | U9.60 | 50.88,28.6 50.52,28.96 U9.2 | U9.2 49.96,28.93 | U9.2 50.01,28.98 50.01,28.93 U9.2 | 48.12,34.65 48.09,34.62 | 48.12,34.65 47.88,34.56 | 47.51,29.07 47.51,28.84 47.75,28.6 48.01,28.7 48.56,28.7 | U4.11 U4.15 40.64,49.28 U4.3 | U9.46 42.97,29.46 43.05,29.54 43.05,29.72 U9.PAD_GND | 44.81,27.77 44.81,26.09 | 44.81,27.77 44.81,27.99 44.78,27.99 44.78,28.68 | U9.55 44.81,27.77 | 40.87,29.44 40.31,29.44 40.06,29.18 39.73,29.18 38.81,28.27
  Top 0.254: U9.60 47.29,28.96 47.5,28.96 47.51,29.07 47.5,31.99 U9.PAD_GND
  Top 0.813: C68.2 49.64,50.14 U10.8
  pour Top: 0.38,79.5 99.44,79.5 99.44,0.76 0.38,0.76
GND_EXT  (via drill 0.6, 1)
  Top 0.813: v32.26,57.53 31.56,56.83 U1.2 | v37.08,57.53 36.38,56.83 U2.2 | v41.91,57.53 41.21,56.83 U3.2
  Top 1.016: v95.76,76.2 J2.1
  Route2 1.676: v95.76,76.2 93.98,77.98 21.46,77.98 20.32,76.83 v20.32,76.71
  Bottom 1.676: v41.91,57.53 v37.08,57.53 v32.26,57.53 30.48,57.53 28.83,59.18 21.84,59.18 20.45,60.58 20.45,76.58 v20.32,76.71
GPI_1_IN  (via drill 0.36)
  Top 0.254: R2.1 C1.1 R53.1 17.69,57.85 v17.68,57.86
  Route15 0.254: GPIO1.3 26.92,66.04 26.92,64.52 20.27,57.86 v17.68,57.86
GPI_2_IN  (via drill 0.36)
  Top 0.254: R6.1 C5.1 23.62,54.7 23.53,54.79 R58.1 23.53,57.64 v23.52,57.66
  Route15 0.254: v23.52,57.66 25.4,57.66 30.48,62.74 31.24,62.74 33.02,64.52 33.02,67.31 GPIO2.3
GPI_3_IN  (via drill 0.36)
  Top 0.203: 30.16,50.39 R8.1 C7.1 30.14,53.44 | 30.14,53.44 R59.1 | 30.14,53.44 v29.06,53.44
  Route2 0.254: GPIO3.3 38.1,67.56 38.1,62.48 37.59,61.98 31.75,61.98 29.06,59.28 v29.06,53.44
GPIO_1
  Route2 0.813: GPIO1.2 30.86,67.18 32.51,68.83 32.51,71.09 X1.4
GPIO_1_PIO  (via drill 0.36)
  Top 0.203: U9.31 42.31,36.67 42.31,37.13 41.51,37.94 41.51,39.65 42.01,40.15 42.01,40.81 41.7,41.12 40.78,41.12 40.24,40.58 v40.24,39.96 | U1.1 29.64,56.39 v28.07,56.39 | D1.C D22.A 19.14,46.45 C2.1
  Top 0.254: R2.2 20.19,51.66 v20.19,51.31 D1.C
  Route15 0.203: v20.19,51.31 20.83,51.31 25.04,55.52 26.98,55.52 27.76,56.31 v28.07,56.39 39.88,56.39 40.89,55.37 40.89,54.36 35.56,49.02 35.56,46.23 40.51,41.27 40.51,40.1 v40.24,39.96
GPIO_2
  Route2 0.813: GPIO2.2 37.59,69.34 37.59,72.73 X1.5
GPIO_2_PIO  (via drill 0.36)
  Top 0.203: U9.42 41.08,31.45 v39.88,31.45 | U2.1 34.23,55.26 v34.24,55.24 | D4.C D27.A 25.49,46.45 C6.1
  Top 0.254: R6.2 v26.33,51.35 26.54,51.15 D4.C
  Route2 0.203: v26.33,51.35 25.95,51.35 24.33,49.73 4.17,49.73 2.08,47.65 2.08,32 3.76,30.33 4.42,30.33 4.83,30.73 37.59,30.73 38.35,31.5 39.83,31.5 v39.88,31.45
  Route15 0.203: v26.33,51.35 31.54,51.35 34.24,54.05 v34.24,55.24
GPIO_3
  Route2 0.813: GPIO3.2 40.51,67.18 42.42,69.09 42.42,74.06 X1.6
GPIO_3_PIO  (via drill 0.36)
  Top 0.203: U3.1 39.37,56.34 v39.37,55.24 | U9.37 39.7,33.96 v38.99,34.67 | C8.1 31.94,44.01 D28.A D6.C 32.1,48.28 v31.57,48.28
  Top 0.254: D6.C v32.89,50.38 R8.2
  Route2 0.203: v31.57,48.28 5.08,48.28 4.72,48.28 4.34,48.28 3.05,46.99 3.05,37.21 8.51,31.75 31.75,31.75 34.67,34.67 v38.99,34.67
  Route15 0.203: v39.37,55.24 35.02,50.38 v32.89,50.38
GPO_1_OUT
  Top 1.016: GPIO1.1 28.68,63.22 R1.1 28.7,61.7 28.7,59.8 U1.3
GPO_2_OUT
  Top 1.016: GPIO2.1 33.76,63.22 R4.1 33.76,59.83 U2.3
GPO_3_OUT
  Top 1.016: GPIO3.1 38.86,63.25 38.86,61.75 | 38.86,61.75 R7.1 | 38.86,61.75 38.86,59.8 U3.3
JTAG-TCK  (via drill 0.36)
  Top 0.203: U9.53 v43.79,28.61
  Route15 0.203: JTAG.5 68.58,20.83 68.07,21.34 48.01,21.34 43.43,25.91 43.43,28.19 43.79,28.55 v43.79,28.61
JTAG-TDI  (via drill 0.36)
  Top 0.203: U9.33 v40.11,35.97
  Route2 0.203: v57.15,16.76 56.9,16.76 47.24,26.42 47.24,31.24 42.16,36.32 40.46,36.32 v40.11,35.97
  Route15 0.203: v57.15,16.76 62.23,16.76 63.5,18.03 JTAG.3
JTAG-TDO  (via drill 0.36)
  Top 0.203: U9.49 41.79,27.16 v41.35,26.77
  Route15 0.203: JTAG.6 71.12,16.26 68.58,13.72 44.45,13.72 41.4,16.76 41.4,26.72 v41.35,26.77
JTAG-TMS  (via drill 0.36)
  Top 0.203: U9.51 v42.79,28.61 v42.8,28.61
  Route15 0.203: JTAG.4 66.04,16.51 63.75,14.22 44.7,14.22 42.04,16.89 42.04,27.85 v42.8,28.61
MISO  (via drill 0.36, 0.46)
  Top 0.203: U9.27 44.3,37.23 44.45,37.38 44.45,39.24 v44.07,39.62 | v9.4,33.02 9.4,29.94 X5.7 | v37.59,47.75 38.72,47.75 U4.6
  Top 0.254: v4.42,61.67 X4.P8
  Route2 0.203: v44.07,39.62 44.07,40.01 44.7,40.64 44.7,41.66 44.2,42.16 40.64,42.16 37.08,45.72 37.08,47.24 v37.59,47.75 | v30.23,38.1 25.91,38.1 23.11,35.31 19.81,35.31 17.27,32.77 9.65,32.77 v9.4,33.02
  Route15 0.203: v44.07,39.62 42.8,38.35 33.02,38.35 32.77,38.1 v30.23,38.1 28.96,38.1 15.62,51.44 15.62,58.8 12.7,61.72 4.47,61.72 v4.42,61.67 4.32,61.77 4.32,66.04 7.62,69.34 MISO.1
MOSI  (via drill 0.36, 0.46)
  Top 0.203: U9.22 46.79,37.13 46.53,37.4 46.53,38.2 46.81,38.49 47.05,38.49 v47.29,38.74 | X5.2 21.52,33.2 v22.1,33.78 | U4.10 44.47,48.28 v44.7,48.51 | v6.86,64.01 X4.P7
  Route2 0.203: v44.7,48.51 45.21,48.51 46.23,47.5 46.23,42.42 46.74,41.91 46.74,39.32 v47.29,38.74 | 22.23,33.78 v22.1,33.78 23.11,34.8 30.48,34.8 31.75,36.07 v31.75,39.12
  Route15 0.203: 47.37,38.73 47.31,38.8 v47.29,38.74 45.72,40.34 42.49,40.34 41.27,39.12 v31.75,39.12 28.7,39.12 16.26,51.56 16.26,59.69 11.94,64.01 v6.86,64.01 6.86,65.53 7.87,66.55 MOSI.1
N$1
  Top 0.203: C66.1 52.83,44.84 52.83,44.2 52.58,43.94 R13.1
N$2
  Top 0.203: PWR_STATUS_3.4 56.64,8.36 56.64,12.03 R62.2
N$3
  Top 0.203: U10.3 51.96,46.89 C66.2 C67.1
N$4
  Top 0.406: R55.2 42.2,10.87 41.35,10.87 40.44,11.79 Q4.3
N$7
  Top 0.203: STATUS_1_2.2 60.45,6.3 60.45,8.38 61.56,9.49 R26.1
N$8
  Top 0.254: U5.6 76.67,32.89 R29.2 76.8,33.02 R32.2
N$9
  Top 0.203: STATUS_1_2.4 62.48,8.33 62.48,12.03 R31.1
N$10
  Top 0.254: U5.2 74.49,27.77 R24.2 76.8,27.69 R23.2
N$12
  Top 0.254: U5.9 68.26,32.93 R37.2 65.95,33.02 R38.2
N$14
  Top 0.254: U5.13 68.26,27.77 R43.2 65.95,27.69 R44.2
N$16
  Top 0.254: U6.1 81.36,13.25 C30.1
N$17
  Top 0.254: U6.3 83.9,13.5 C30.2
N$18
  Top 0.254: U6.4 85.17,13.17 C35.1
N$19
  Top 0.254: U6.5 86.44,13.17 C35.2
N$20
  Top 0.254: U6.2 82.63,17.45 82.3,17.78 79.67,17.78 C33.2
N$21
  Top 0.254: U6.6 87.71,13.5 C34.1
N$22
  Top 0.203: PWR_STATUS_3.2 54.61,6.33 54.61,8.38 55.71,9.49 R48.1
N$40
  Top 0.203: R54.1 C47.1
N$100  (via drill 0.36, 0.7)
  Top 0.203: TEST.2 v36.2,26.92 | v39.12,32.26 40.18,32.26 40.38,32.46 U9.40 | 36.31,28.45 SW4.P$2 v36.2,26.92 | R52.1 34.19,27.53 34.8,26.92 v36.2,26.92
  Route15 0.203: v39.12,32.26 36.2,29.34 v36.2,26.92
N$300
  Top 0.203: 46.32,12.45 46.44,12.57 46.48,12.57 45.59,13.46 43.05,13.46 42.29,12.7 R55.1
  Top 0.254: X6.3 45.97,8.94 46.43,9.4 46.43,10.2 C50.2 46.32,12.45 R56.1
N$400
  Top 0.254: X6.2 45.17,8.93 44.7,9.4 44.7,9.95 C50.1 44.62,12.45 R57.1
N$800
  Top 0.406: U7.5 87.54,34.15 R50.2 R51.1
N$900
  Top 0.61: C39.2 91.92,40.21 U7.1
N$1000
  Top 0.254: 89.55,42.76 89.83,43.03 L3.P$2
  Top 0.61: C39.1 95.29,42.41 D25.C
  Top 1.016: U7.3 89.26,43.05 89.26,43.26 89.41,43.41
  Top 1.778: D25.C 89.55,42.76 89.26,43.05
N$1100
  Top 0.406: R49.2 C40.2
N$1200
  Top 0.406: 89.28,34.04 91.19,32.13 R49.1
  Top 0.61: U7.6 89.28,34.57 89.28,34.04
N$1300
  Top 0.61: C42.2 91.86,34.53 U7.8
N$1500
  Top 1.676: L2.1 94.05,64.4 D24.P$1
NPCS0  (via drill 0.36)
  Top 0.203: U9.28 43.81,36.68 43.81,37.34 44.02,37.54 44.02,38.53 43.31,39.24 v42.67,39.24 | v24.38,33.78 24.38,30 X5.1
  Route2 0.203: v42.67,39.24 41.27,37.85 39.62,37.85 37.85,36.07 33.02,36.07 31.24,34.29 24.89,34.29 v24.38,33.78
NPCS1  (via drill 0.36)
  Top 0.203: U9.30 42.79,36.95 42.8,36.96 42.8,37.31 41.95,38.15 41.95,39.51 42.41,39.97 42.41,41.15 41.97,41.54 40.6,41.54 39.96,40.9 v39.58,40.9 | X4.P1 v14.48,64.13 v14.48,64.14 14.48,65.28 NPCS1.1
  Route15 0.203: v39.58,40.9 33.67,46.81 21.89,46.81 16.89,51.82 16.89,61.72 v14.48,64.14
NPCS2  (via drill 0.36, 0.46)
  Top 0.203: U4.9 44.42,47.78 v44.96,47.24 | U9.29 43.29,37.58 v43.28,37.8
  Route2 0.203: v44.96,47.24 38.15,47.24 37.59,46.69 37.59,46.23 41.15,42.67 44.45,42.67 45.21,41.91 45.21,38.86 44.2,37.85 43.33,37.85 v43.28,37.8
PLLRC
  Top 0.203: 48.82,27.23 48.95,27.1 48.95,26.7 49.28,26.36 49.28,24.38 49.78,23.88 R54.2
  Top 0.254: C48.1 R54.2 | 48.82,27.23 48.82,27.78 U9.63
RESET  (via drill 0.36, 0.7)
  Top 0.203: SW3.P$1 v36.2,32.26 RESET.1 | v39.88,32.94 40.2,32.96 U9.39
  Route2 0.203: v40.64,20.83 v43.43,20.83
  Route15 0.203: v39.88,32.94 39.42,33.4 37.85,33.4 36.7,32.26 v36.2,32.26 34.8,30.86 34.8,24.13 38.1,20.83 v40.64,20.83 | JTAG.2 59.18,20.83 v43.43,20.83
RXD0  (via drill 0.36)
  Top 0.203: U6.12 86.36,21.54 v86.36,19.81 | v40.13,34.92 40.16,34.96 U9.35
  Route15 0.203: v86.36,19.81 86.36,21.21 85.72,21.84 48.26,21.84 45.09,25.02 45.09,30.1 42.47,32.72 41.58,32.72 40.13,34.16 v40.13,34.92
RXD0_JACK  (via drill 0.36)
  Top 0.254: U6.13 85.17,19.99 v85.22,19.81
  Route15 0.254: v85.22,19.81 85.22,11.18 85.24,11.15 85.24,7.26 82.55,4.57 79.76,4.57 79.25,5.08 79.25,6.27 X3.P1-3
RXD1  (via drill 0.36)
  Top 0.203: U6.9 90.3,21.57 v90.3,19.81 | v49.13,33.46 U9.11
  Route15 0.203: v90.3,19.81 90.3,21.46 87.88,23.88 49.28,23.88 48.26,24.89 48.26,33 48.72,33.46 v49.13,33.46
RXD1_JACK  (via drill 0.36)
  Top 0.254: U6.8 90.25,17.2 v90.17,17.27
  Route15 0.254: v90.17,17.27 94.49,12.95 94.49,5.33 93.47,4.32 91.19,4.32 90.42,5.08 90.42,6.28 X3.P2-3
SAFE12V  (via drill 0.36, 0.6)
  Top 0.406: v63.75,52.45 63.75,50.86 R25.1
  Top 1.016: U7.2 90.53,38.53 v90.47,38.48 | v91.44,64.77 91.14,64.47 D24.P$3
  Top 1.676: C43.+ 88.9,56.83 v88.9,55.12
  Route15 0.203: v63.75,52.45 63.75,52.58 65.02,53.85 65.02,72.39 65.79,73.15 65.79,76.2 67.06,77.47 85.34,77.47 86.36,76.45 86.36,66.8 88.39,64.77 v91.44,64.77
  Route15 1.676: v90.47,38.48 88.9,40.06 v88.9,55.12 91.44,57.66 v91.44,64.77
SD_CARD_DETECT  (via drill 0.36)
  Top 0.203: v41.95,31.96 U9.41 | U9.41 | v19.96,28.14 19.96,29.54 X5.CD
  Route2 0.203: v41.95,31.96 40.67,30.68 39.17,30.68 38.71,30.23 21.59,30.23 19.96,28.6 v19.96,28.14
SD_WRITE_PROTECT  (via drill 0.36)
  Top 0.203: v41.96,33.46 U9.38 | v4.19,31.11 4.19,29.78 X5.WP
  Route2 0.203: v4.19,31.11 4.32,31.24 32,31.24 34.42,33.66 41.76,33.66 v41.96,33.46
SPCK  (via drill 0.36, 0.46)
  Top 0.203: v47.29,37.6 U9.21 | X5.5 14.02,33.07 v14.48,33.53 | U4.7 38.61,47.28 v38.61,46.48 | X4.P2 v13.21,59.44
  Route2 0.203: v47.29,37.6 45.72,39.18 45.72,42.16 44.7,43.18 41.66,43.18 38.61,46.23 v38.61,46.48 | v25.65,40.13 25.65,38.86 22.86,36.07 16.51,36.07 14.48,34.04 v14.48,33.53 | SPCK.1 11.94,60.71 v13.21,59.44
  Route15 0.203: v47.29,37.6 46.52,36.83 42.42,36.83 41.91,37.34 28.45,37.34 v25.65,40.13 25.65,40.64 14.86,51.44 14.86,57.78 v13.21,59.44
STATUS_LED_1-1  (via drill 0.36)
  Top 0.203: U9.47 40.54,28.96 v39.88,28.3 | v58.42,10.92 R26.2
  Route2 0.203: v39.88,28.3 40.13,28.55 41.4,28.55 42.04,27.91 42.04,26.01 43.16,24.89 44.37,24.89 47.19,22.07 48.92,22.07 57.15,13.84 57.15,11.68 57.91,10.92 v58.42,10.92
STATUS_LED_1-2  (via drill 0.36)
  Top 0.203: v41.95,30.45 U9.44 | v58.42,12.95 R31.2
  Route2 0.203: v41.95,30.45 41.97,30.48 44.2,30.48 45.09,29.59 45.09,25.02 47.5,22.61 49.53,22.61 58.42,13.72 v58.42,12.95
STATUS_LED_1-3  (via drill 0.36)
  Top 0.203: U9.52 43.31,27.74 43.31,27.05 43,26.75 v42.75,26.77 | v53.77,15.04 53.76,15.03 R62.1
  Route15 0.203: v42.75,26.77 42.75,20.5 48.21,15.04 v53.77,15.04
TXD0  (via drill 0.36)
  Top 0.203: U6.11 87.76,21.57 v87.76,19.81 | v41.97,35.43 41.94,35.46 U9.34
  Route15 0.203: v87.76,19.81 87.76,21.46 86.74,22.48 48.51,22.48 45.72,25.27 45.72,32 42.29,35.43 42.16,35.43 v41.97,35.43
TXD0_JACK  (via drill 0.36)
  Top 0.254: U6.14 83.9,19.99 v83.95,19.81
  Route15 0.254: v83.95,19.81 83.95,11.05 81.79,8.89 80.31,8.89 X3.P1-2
TXD1  (via drill 0.36)
  Top 0.203: U6.10 89.03,21.57 v89.03,19.81 | v49.13,34.95 v49.12,34.96 U9.14
  Route15 0.203: v89.03,19.81 89.03,21.46 87.38,23.11 48.9,23.11 47.24,24.77 47.24,33.02 49.13,34.91 v49.13,34.95
TXD1_JACK  (via drill 0.36)
  Top 0.254: U6.7 88.98,17.07 v88.9,17.27
  Route15 0.254: v88.9,17.27 88.9,13.72 91.44,11.18 91.44,8.96 X3.P2-2
USB_PULLUP  (via drill 0.36)
  Top 0.203: U9.19 48.29,37.15 47.98,37.47 47.98,39.34 v47.55,39.78 | v39.52,13.72 39.37,13.72 38.39,12.74 Q4.1
  Route2 0.203: v47.55,39.78 48.11,39.22 48.11,36.98 48.72,36.37 48.72,35.61 47.85,34.75 47.85,27.08 60.55,14.38 71.73,14.38 73.15,12.95 73.15,10.92 71.37,9.14 46.94,9.14 42.37,13.72 v39.52,13.72
V+  (via drill 0.36, 0.46, 0.7)
  Top 0.203: 48.79,36.61 v48.79,37.67 C53.2 | U9.58 U9.59 46.81,27.79 | U9.45 41.13,29.97 v39.88,29.97 | 53.05,31.45 51.99,31.45 v52.09,31.45 | U9.7 49.97,31.46 49.98,31.45 50.37,31.45 50.42,31.39 52.05,31.39 v52.09,31.45 | v51.31,27.53 50.26,28.46 U9.1 | v37.85,23.62 TEST.1 | v52.09,31.45 52.07,31.42
  Top 0.254: U9.45 41.14,29.97 v39.88,29.97 C52.2 | 48.79,36.61 U9.18 | U9.59 46.79,27.11 46.66,26.72 | 53.05,31.45 C56.1
  Top 0.305: TEST.1 SW4.P$1 | v43.43,45.72 43.55,45.83 U4.8
  Top 0.406: 46.81,25.69 v46.56,26.34 46.66,26.72 | v36.68,10.87 36.71,10.84 Q4.2 | C68.1 47.89,50.5 U10.9 | C65.1 43.43,44.56 v43.43,45.72
  Top 0.61: C56.1 C55.1 | 46.81,25.69 C51.2
  Top 0.813: U10.1 48.09,47.67 47.37,48.39 v47.37,48.77 47.37,49.4 47.84,49.87 U10.9
  Top 1.016: U8.2 29.06,33.27 v30.1,33.27 31.52,33.27 C44.+ | v16.51,33.91 16.52,33.28 16.52,32.02 | X5.4 16.52,32.02 | 16.52,32.02 C64.+
  Bottom 0.203: 48.77,37.72 48.79,37.69 v48.79,37.67
  Bottom 0.406: v37.85,23.62 37.85,21.59 36.68,20.42 v36.68,10.87
  Bottom 1.016: 49.23,37.67 v48.79,37.67 51.23,37.67 52.3,36.6 52.3,31.77 v52.09,31.45 52.3,31.11 52.3,28.52 v51.31,27.53 51.31,26.21 50.98,25.88 | 50.98,25.88 47.02,25.88 v46.56,26.34 45.87,25.65 40.03,25.65 39.41,26.28 | 48.77,37.72 48.77,44.96 47.37,46.35 | 50.98,25.88 55.5,25.88 58.45,22.94 58.45,19.07 JTAG.1 | 39.41,26.28 38.61,27.08 38.61,28.96 38.61,29.03 39.55,29.97 v39.88,29.97 | v37.85,23.62 37.87,23.65 37.87,24.92 39.23,26.28 39.41,26.28 | 47.37,46.35 v47.37,48.77 | 47.37,46.35 46.74,45.72 v43.43,45.72
  Bottom 1.27: v16.51,33.91 18.16,32.26 26.42,32.26 27.43,33.27 v30.1,33.27
  Bottom 1.422: v30.1,33.27 30.23,33.02 30.23,29.46 30.73,28.96 38.61,28.96
VBUS  (via drill 0.6)
  Top 0.61: X6.1 44.37,8.33 v43.94,8.89
  Top 0.813: D26.A v37.86,16.51 37.31,15.96 C57.+
  Route2 0.813: v43.94,8.89 41.53,8.89 37.85,12.57 37.85,16.49 v37.86,16.51
VDDOUT  (via drill 0.36)
  Top 0.203: U9.8 49.96,31.98 50.47,31.95 51.05,31.95 v51.18,32.08 | U9.24 45.8,36.61 45.8,37.26 | v49.78,27 49.61,27.1 | U9.64 49.3,27.8 49.3,27.46 v49.78,27 | v49.78,27 49.66,27.13 | C61.2 53.01,34.53 53.01,34.56 | U9.54 44.3,26.92 v44.12,26.77
  Top 0.254: 51.23,33.96 49.95,33.96 U9.12 | U9.64 49.29,27.44 49.54,27.19 | 49.54,27.19 49.71,27.03 49.71,26.2 C58.2 | U9.54 | C60.2 43.79,26.24 44.32,26.77 44.3,26.8 v44.12,26.77 | 49.61,27.1 49.54,27.16 49.54,27.19
  Top 0.406: 51.23,33.96 v51.18,34.01 52.53,34.01 52.76,34.19 53.01,34.56 | v45.8,37.77 45.8,37.26
  Top 0.61: C61.2 C62.2 | v45.8,37.77 C59.2
  Bottom 0.406: 51.18,33.91 50.09,33.91 49.96,34.04 49.96,36.32 49.53,36.7 46.1,36.7 45.79,37.01 v45.79,37.77 v45.8,37.77 | 51.18,33.91 51.23,33.91 | v51.18,34.01 51.18,33.91
  Bottom 0.61: v51.18,34.01 v51.18,32.08 50.95,32 50.04,31.09 50.04,27.25 v49.78,27 47.78,27 47.35,27.43 45.31,27.43 44.65,26.77 v44.12,26.77
VREF  (via drill 0.36)
  Top 0.61: v80.01,71.63 80.75,71.63 R47.1
  Route15 0.61: v80.01,71.63 72.34,71.63 70.82,73.15 X1.14
VREF_PROTECT
  Top 0.61: L1.2 84.83,65.41 | L1.2 84.58,67.9 C37.1 84.03,70.48 R47.2 | 84.84,64.52 84.58,64.52 L1.2
  Top 1.016: 84.84,64.52 84.69,64.36 C38.+
XIN1
  Top 0.203: 47.8,27.8 47.8,26.62 48.39,26.04 48.39,22.61 49.63,21.36 49.63,18.19 48.76,17.32 | 48.76,17.32 Q1.1 C46.2 | 48.76,17.32 48.76,17.03
  Top 0.254: 47.8,27.8 U9.61
XOUT1
  Top 0.203: 48.31,27.79 48.31,26.72 48.87,26.16 48.87,23.01 50.09,21.79 50.09,20.73 51.3,19.52 Q1.3 52.37,19.52 C45.2 | 51.46,19.81 51.18,19.81
  Top 0.254: 48.31,27.79 U9.62 | 51.46,19.81 Q1.3 51.64,19.9

## Text on the board
tPlace: IN | OUT | ANALOG | RaceCapture/Pro | DIGITAL | www.autosportlabs.com | ACTION | Copyright 2008-2012 | Rev F